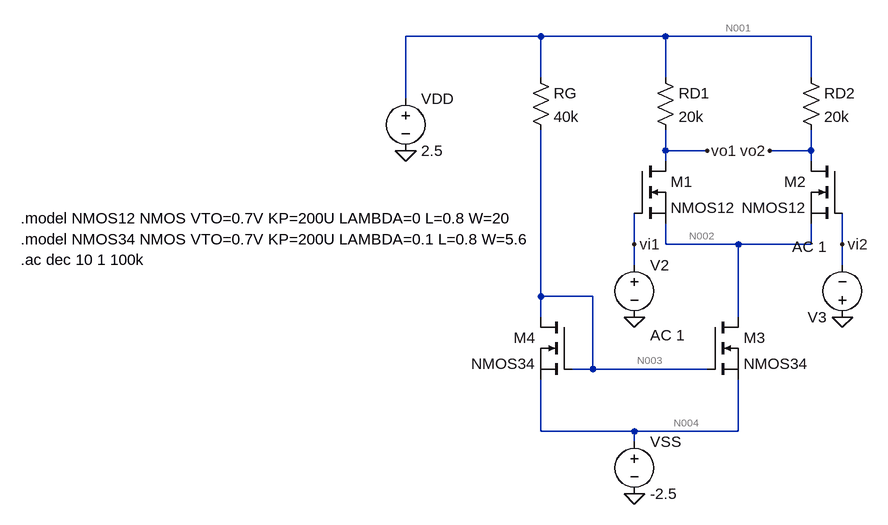
[diagram p0: schematic fig.asc]
fig.asc, the LTspice schematic file:
Version 4
SHEET 1 888 724
WIRE 176 0 -32 0
WIRE 368 0 176 0
WIRE 592 0 368 0
WIRE 176 64 176 0
WIRE 368 64 368 0
WIRE 592 64 592 0
WIRE -32 96 -32 0
WIRE 368 176 368 144
WIRE 432 176 368 176
WIRE 592 176 592 144
WIRE 592 176 528 176
WIRE 368 192 368 176
WIRE 592 192 592 176
WIRE 320 320 320 272
WIRE 368 320 368 288
WIRE 480 320 368 320
WIRE 592 320 592 288
WIRE 592 320 480 320
WIRE 640 320 640 272
WIRE 320 352 320 320
WIRE 640 352 640 320
WIRE 176 400 176 144
WIRE 256 400 176 400
WIRE 176 432 176 400
WIRE 480 432 480 320
WIRE 256 512 256 400
WIRE 256 512 224 512
WIRE 432 512 256 512
WIRE 176 608 176 528
WIRE 320 608 176 608
WIRE 480 608 480 528
WIRE 480 608 320 608
WIRE 320 624 320 608
FLAG -32 176 0
FLAG 320 432 0
FLAG 640 432 0
FLAG 320 704 0
FLAG 432 176 vo1
FLAG 528 176 vo2
FLAG 320 320 vi1
FLAG 640 320 vi2
SYMBOL voltage -32 80 R0
SYMATTR InstName VDD
SYMATTR Value 2.5
SYMBOL res 160 48 R0
SYMATTR InstName RG
SYMATTR Value 40k
SYMBOL res 352 48 R0
SYMATTR InstName RD1
SYMATTR Value 20k
SYMBOL res 576 48 R0
SYMATTR InstName RD2
SYMATTR Value 20k
SYMBOL nmos 320 192 R0
SYMATTR InstName M1
SYMATTR Value NMOS12
SYMBOL nmos 640 192 M0
SYMATTR InstName M2
SYMATTR Value NMOS12
SYMBOL voltage 640 448 R180
WINDOW 123 24 124 Left 2
WINDOW 39 0 0 Left 0
SYMATTR InstName V3
SYMATTR Value ""
SYMATTR Value2 AC 1
SYMBOL voltage 320 336 R0
WINDOW 123 24 124 Left 2
WINDOW 39 0 0 Left 0
SYMATTR InstName V2
SYMATTR Value ""
SYMATTR Value2 AC 1
SYMBOL nmos 432 432 R0
SYMATTR InstName M3
SYMATTR Value NMOS34
SYMBOL nmos 224 432 M0
SYMATTR InstName M4
SYMATTR Value NMOS34
SYMBOL voltage 320 608 R0
SYMATTR InstName VSS
SYMATTR Value -2.5
TEXT -624 280 Left 2 !.model NMOS12 NMOS VTO=0.7V KP=200U LAMBDA=0 L=0.8 W=20
TEXT -624 312 Left 2 !.model NMOS34 NMOS VTO=0.7V KP=200U LAMBDA=0.1 L=0.8 W=5.6
TEXT -624 344 Left 2 !.ac dec 10 1 100k

The netlist it stands for:
* fig.asc
VDD N001 0 2.5
RG N001 N003 40k
RD1 N001 vo1 20k
RD2 N001 vo2 20k
M1 vo1 vi1 N002 N002 NMOS12
M2 vo2 vi2 N002 N002 NMOS12
V3 0 vi2 AC 1
V2 vi1 0 AC 1
M3 N002 N003 N004 N004 NMOS34
M4 N003 N003 N004 N004 NMOS34
VSS N004 0 -2.5
.model NMOS NMOS
.model PMOS PMOS
.lib standard.mos
.model NMOS12 NMOS VTO=0.7V KP=200U LAMBDA=0 L=0.8 W=20
.model NMOS34 NMOS VTO=0.7V KP=200U LAMBDA=0.1 L=0.8 W=5.6
.ac dec 10 1 100k
.backanno
.end

* Results of the author's LTspice run, read from the files saved beside the schematic
* Operating Point, zero values left out:
*   V(n001) = 2.5 V
*   V(n003) = -1.443 V
*   V(vo1) = 1.461 V
*   V(vo2) = 1.461 V
*   V(n002) = -844.2 mV
*   V(n004) = -2.5 V
*   Id(M4) = 98.58 µA
*   Ib(M4) = -1.067 pA
*   Is(M4) = -98.58 µA
*   Id(M3) = 103.9 µA
*   Ib(M3) = -1.666 pA
*   Is(M3) = -103.9 µA
*   Id(M2) = 51.96 µA
*   Ib(M2) = -2.315 pA
*   Is(M2) = -51.96 µA
*   Id(M1) = 51.96 µA
*   Ib(M1) = -2.315 pA
*   Is(M1) = -51.96 µA
*   I(Rd2) = 51.96 µA
*   I(Rd1) = 51.96 µA
*   I(Rg) = 98.58 µA
*   I(Vss) = 202.5 µA
*   I(Vdd) = -202.5 µA